# Altium project Board_SN.PrjPcb
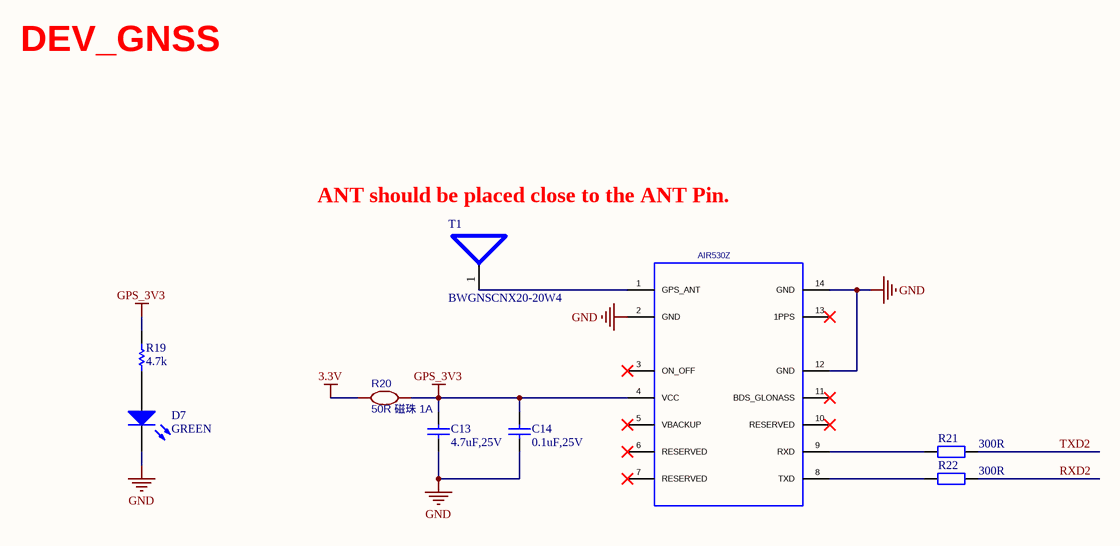
[diagram p0: GNSS.SchDoc]
5 sheets, 108 parts. Net scope: global (net labels, ports and power ports of the same name join across sheets).
Sheets:
  GNSS.SchDoc
  MCU.SchDoc
  Audio.SchDoc
  Device.SchDoc
  POWER.SchDoc

## Sheet GNSS.SchDoc
size A4

### Parts
C13  value 4.7uF,25V  [0402_C]  (hidden comment: Cap)
C14  value 0.1uF,25V  [0402_C]  (hidden comment: Cap)
D7  value GREEN  [0603_LED]  (hidden comment: LED)
R19  value 4.7k  [0603_R]  (hidden comment: Res_5%)
R20  50R 磁珠 1A  [0402_R]
R21  value 300R  [0603_R]  (hidden comment: Res)
R22  value 300R  [0603_R]  (hidden comment: Res)
T1  BWGNSCNX20-20W4  [ANT-TH_BWGNSCNX20-20W4]
U5  AIR530Z  [AIR530]

### Nets
3.3V: R20.2
GND: C13.2 C14.2 D7.2(K) U5.2(GND) U5.12(GND) U5.14(GND)
GPS_3V3: C13.1 C14.1 R19.2 R20.1 U5.4(VCC)
RXD2: R22.2
TXD2: R21.2
NetD7_1: D7.1(A) R19.1
NetR21_1: R21.1 U5.9(RXD)
NetR22_1: R22.1 U5.8(TXD)
NetT1_1: T1.1 U5.1(GPS_ANT)

Not connected (* = marked no-connect by the designer): U5 3(ON_OFF)* 5(VBACKUP)* 6(RESERVED)* 7(RESERVED)* 10(RESERVED)* 11(BDS_GLONASS)* 13(1PPS)*

### Notes on the sheet
- DEV_GNSS
- ANT should be placed close to the ANT Pin.

### Library data of the parts
C13 C14 = T_Cap_0603_0.1uF_25V_X5R: 贴片电容; Part Typer: X5R; Solder: SMD; Withstand Voltage: 25V; Tolerance: 10%; Schematic Path: X:\Database\Schematic Library.Schlib; Part Number: T_Cap_0603_0.1uF_25V_X5R; LibRef: T_Cap_0603_0.1uF_25V_X5R
D7 = T_LED_Red_0805: 红色LED灯; Solder: SMD; Schematic Path: X:\Database\Schematic Library.Schlib; Part Number: T_LED_Red_0805; LibRef: T_LED_Red_0805
R19 = T_Res_0603_10k_5%_1/10W: 贴片电阻; Solder: SMD; Power: 1/10W; Tolerance: 5%; Schematic Path: X:\Database\Schematic Library.Schlib; Part Number: T_Res_0603_10k_5%_1/10W; LibRef: T_Res_0603_10k_5%_1/10W
R20 = 100k: nameAlias: Value(Ω); Contributor: LCEDA_Lib; spicePre: R; spiceSymbolName: R_0603_EU
R21 R22 = T_Res_0603_49.9k_1%_1/10W: 贴片电阻; Solder: SMD; Power: 1/10W; Tolerance: 1%; Schematic Path: X:\Database\Schematic Library.Schlib; Part Number: T_Res_0603_49.9k_1%_1/10W; LibRef: T_Res_0603_49.9k_1%_1/10W
T1 = ANT
U5 = AIR530Z: GPS/Beidou/GLONASS module;9.9*12.9*2.3mm; Manufacture: Luat; Geometry.Height: 2.3mm; Manufacturer P/N: Air530Z; PCB DECAL: AIR530

## Sheet MCU.SchDoc
size A4
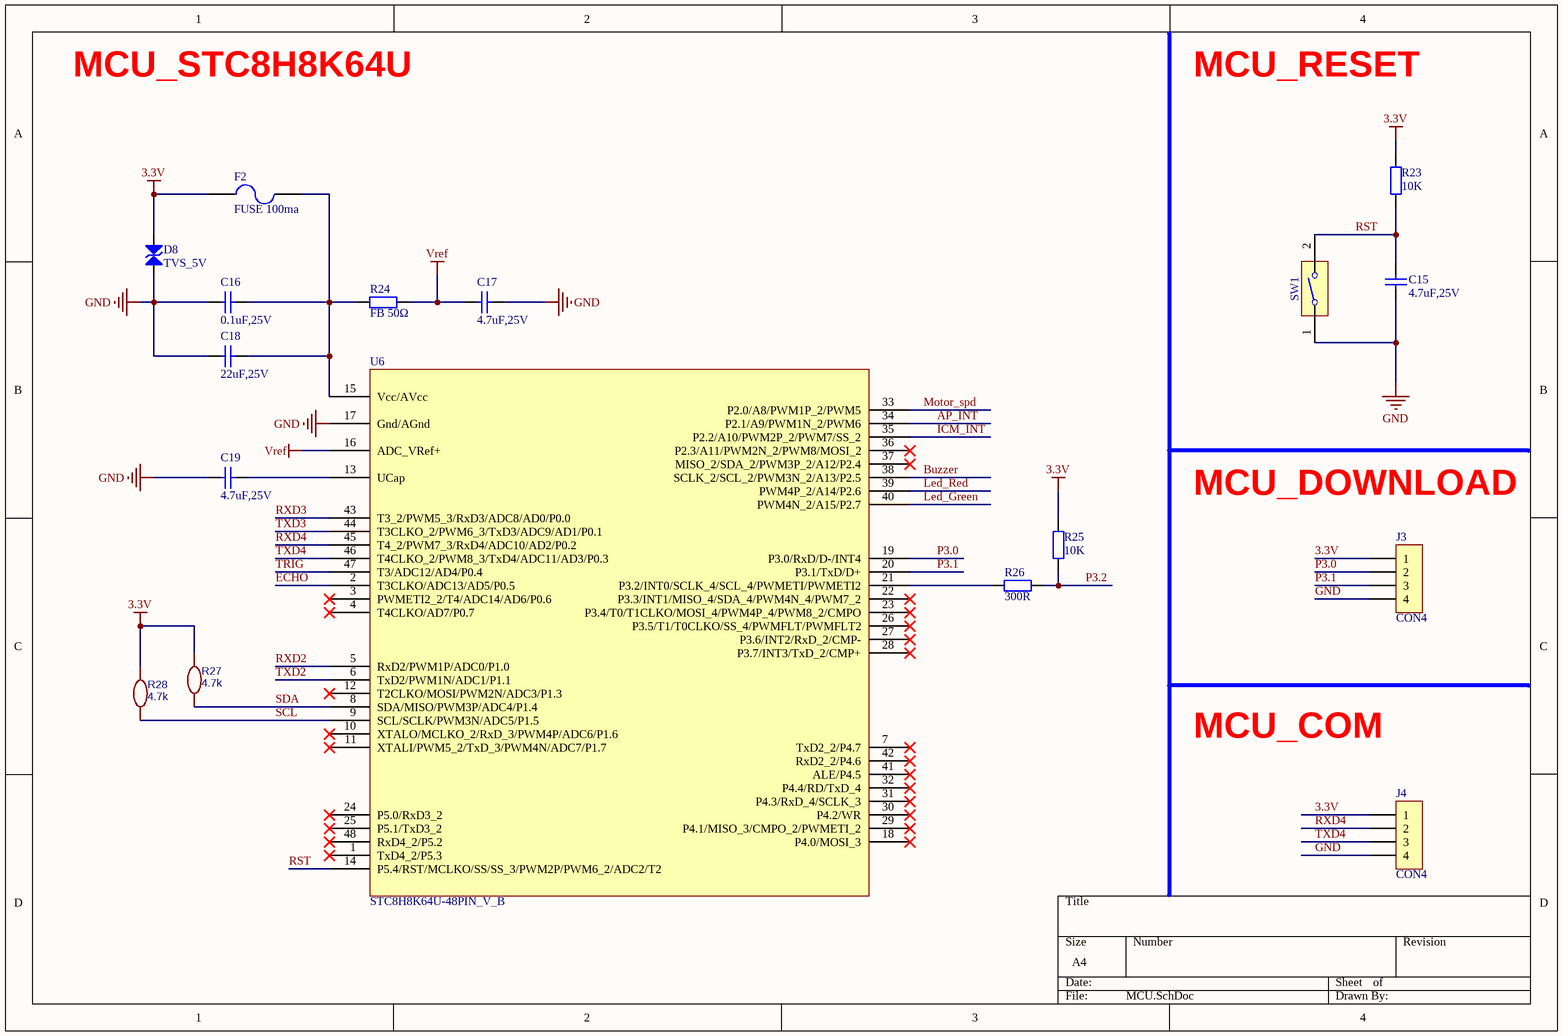
[diagram p1: MCU.SchDoc]

### Parts
C15  value 4.7uF,25V  [0603_C]  (hidden comment: Cap)
C16  value 0.1uF,25V  [0603_C]  (hidden comment: Cap)
C17  value 4.7uF,25V  [0603_C]  (hidden comment: Cap)
C18  value 22uF,25V  [0603_C]  (hidden comment: Cap)
C19  value 4.7uF,25V  [0603_C]  (hidden comment: Cap)
D8  TVS_5V  [SOD-323]
F2  FUSE 100ma  [1206_FUSE]
J3  CON4
J4  CON4
R23  value 10K  [0603_R]  (hidden comment: Res)
R24  value FB 50Ω  [0603_R]  (hidden comment: Res)
R25  value 10K  [0603_R]  (hidden comment: Res)
R26  value 300R  [0603_R]  (hidden comment: Res)
R27  4.7k  [0402_R]
R28  4.7k  [0402_R]
SW1  (no value)
U6  STC8H8K64U-48PIN_V_B  [QFN48(6X6mm)]

### Nets
3.3V: D8.1 F2.2 J3.1 J4.1 R23.1 R25.1 R27.1 R28.1
GND: C15.2 C16.1 C17.1 C18.1 C19.2 D8.2 J3.4 J4.4 SW1.1 U6.17(Gnd/AGnd)
Vref: C17.2 R24.1 U6.16(ADC_VRef+)
AP_INT: U6.34(P2.1/A9/PWM1N_2/PWM6)
Buzzer: U6.38(SCLK_2/SCL_2/PWM3N_2/A13/P2.5)
ECHO: U6.2(T3CLKO/ADC13/AD5/P0.5)
ICM_INT: U6.35(P2.2/A10/PWM2P_2/PWM7/SS_2)
Led_Green: U6.40(PWM4N_2/A15/P2.7)
Led_Red: U6.39(PWM4P_2/A14/P2.6)
Motor_spd: U6.33(P2.0/A8/PWM1P_2/PWM5)
P3.0: J3.2 U6.19(P3.0/RxD/D-/INT4)
P3.1: J3.3 U6.20(P3.1/TxD/D+)
P3.2: R25.2 R26.2
RST: C15.1 R23.2 SW1.2 U6.14(P5.4/RST/MCLKO/SS/SS_3/PWM2P/PWM6_2/ADC2/T2)
RXD2: U6.5(RxD2/PWM1P/ADC0/P1.0)
RXD3: U6.43(T3_2/PWM5_3/RxD3/ADC8/AD0/P0.0)
RXD4: J4.2 U6.45(T4_2/PWM7_3/RxD4/ADC10/AD2/P0.2)
SCL: R28.2 U6.9(SCL/SCLK/PWM3N/ADC5/P1.5)
SDA: R27.2 U6.8(SDA/MISO/PWM3P/ADC4/P1.4)
TRIG: U6.47(T3/ADC12/AD4/P0.4)
TXD2: U6.6(TxD2/PWM1N/ADC1/P1.1)
TXD3: U6.44(T3CLKO_2/PWM6_3/TxD3/ADC9/AD1/P0.1)
TXD4: J4.3 U6.46(T4CLKO_2/PWM8_3/TxD4/ADC11/AD3/P0.3)
NetC16_2: C16.2 C18.2 F2.1 R24.2 U6.15(Vcc/AVcc)
NetC19_1: C19.1 U6.13(UCap)
NetR26_1: R26.1 U6.21(P3.2/INT0/SCLK_4/SCL_4/PWMETI/PWMETI2)

Not connected (* = marked no-connect by the designer): U6 1(TxD4_2/P5.3)* 3(PWMETI2_2/T4/ADC14/AD6/P0.6)* 4(T4CLKO/AD7/P0.7)* 7(TxD2_2/P4.7)* 10(XTALO/MCLKO_2/RxD_3/PWM4P/ADC6/P1.6)* 11(XTALI/PWM5_2/TxD_3/PWM4N/ADC7/P1.7)* 12(T2CLKO/MOSI/PWM2N/ADC3/P1.3)* 18(P4.0/MOSI_3)* 22(P3.3/INT1/MISO_4/SDA_4/PWM4N_4/PWM7_2)* 23(P3.4/T0/T1CLKO/MOSI_4/PWM4P_4/PWM8_2/CMPO)* 24(P5.0/RxD3_2)* 25(P5.1/TxD3_2)* 26(P3.5/T1/T0CLKO/SS_4/PWMFLT/PWMFLT2)* 27(P3.6/INT2/RxD_2/CMP-)* 28(P3.7/INT3/TxD_2/CMP+)* 29(P4.1/MISO_3/CMPO_2/PWMETI_2)* 30(P4.2/WR)* 31(P4.3/RxD_4/SCLK_3)* 32(P4.4/RD/TxD_4)* 36(P2.3/A11/PWM2N_2/PWM8/MOSI_2)* 37(MISO_2/SDA_2/PWM3P_2/A12/P2.4)* 41(ALE/P4.5)* 42(RxD2_2/P4.6)* 48(RxD4_2/P5.2)*

### Notes on the sheet
- MCU_STC8H8K64U
- MCU_RESET
- MCU_DOWNLOAD
- MCU_COM

### Library data of the parts
C15-C19 = T_Cap_0603_2.2uF_25V_Y5V: 贴片电容; Part Typer: Y5V; Solder: SMD; Withstand Voltage: 25V; Tolerance: 20%; Schematic Path: X:\Database\Schematic Library.Schlib; Part Number: T_Cap_0603_2.2uF_25V_Y5V; LibRef: T_Cap_0603_2.2uF_25V_Y5V
D8 = TBV05C: TVS,ESD二极管
F2 = Fuse 2: Fuse; Published: 8-Jun-2000; LatestRevisionDate: 17-Jul-2002; LatestRevisionNote: Re-released for DXP Platform.; PackageReference: PIN-W2/E2.8; Publisher: Altium Limited
J3 J4 = CON4: Connector
R23-R26 = T_Res_0603_49.9k_1%_1/10W: as R21 on sheet GNSS; Part Number: T_Res_0603_49.9k_1%_1/10W; LibRef: T_Res_0603_49.9k_1%_1/10W
R27 R28 = 100k: as R20 on sheet GNSS; spicePre: R; spiceSymbolName: R_0603_EU
SW1 = SW 1x SPST DIP Switch: 1 Ways SPST DIP Switch
U6 = STC8H8K64U-48PIN

## Sheet Audio.SchDoc
size A4
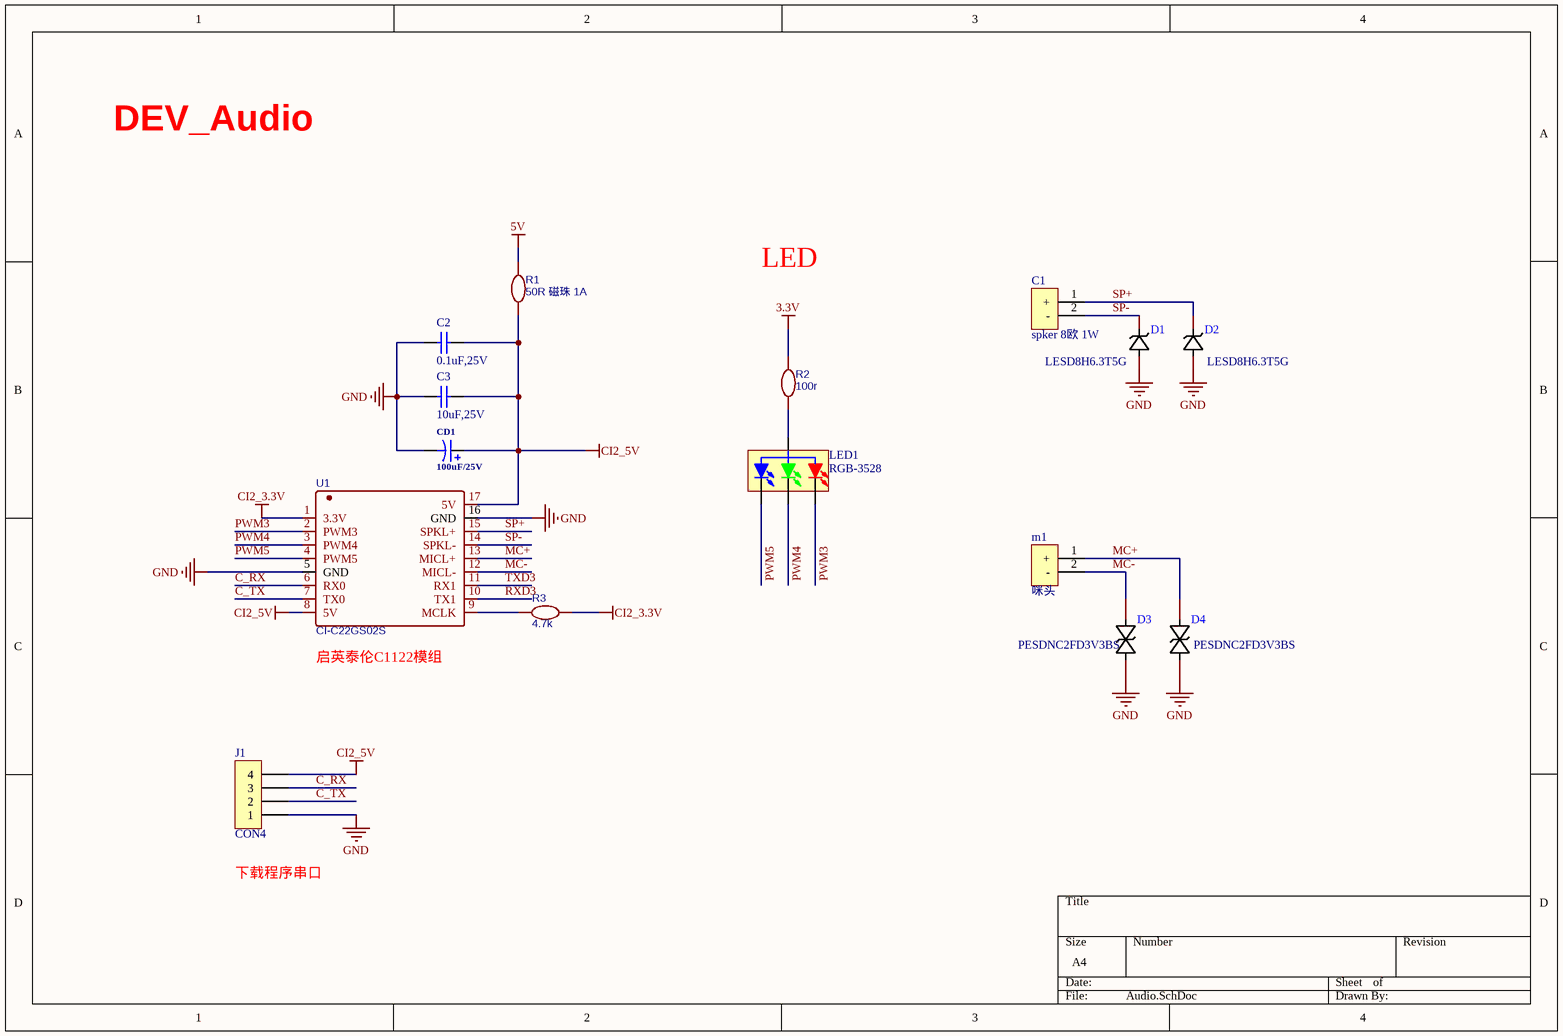
[diagram p2: Audio.SchDoc]

### Parts
C1  spker 8欧 1W  [XH2.54A-2]
C2  value 0.1uF,25V  [0402_C]  (hidden comment: Cap)
C3  value 10uF,25V  [0402_C]  (hidden comment: Cap)
CD1  100uF/25V  [CD7343]
D1  LESD8H6.3T5G  [SOD-882_L1.0-W0.6-R-RD]
D2  LESD8H6.3T5G  [SOD-882_L1.0-W0.6-R-RD]
D3  PESDNC2FD3V3BS  [DFN1006-2L-BI]
D4  PESDNC2FD3V3BS  [DFN1006-2L-BI]
J1  CON4
LED1  RGB-3528  [LED-TH_4P-BD6.9-P1.27-R]
m1  咪头  [MIC-TH_BD6.0-P1.90-D0.4-L-RD]
R1  50R 磁珠 1A  [0402_R]
R2  100r  [0402_R]
R3  4.7k  [0402_R]
U1  CI-C22GS02S  [SMD-17_L20.0-W1.80-CI-C22GS02S]

### Nets
3.3V: R2.2
5V: R1.2
CI2_3.3V: R3.1 U1.1(3.3V)
CI2_5V: C2.1 C3.1 CD1.1 J1.4 R1.1 U1.8(5V) U1.17(5V)
GND: C2.2 C3.2 CD1.2 D1.1(A) D2.1(A) D3.2(K) D4.2(K) J1.1 U1.5(GND) U1.16(GND)
C_RX: J1.3 U1.6(RX0)
C_TX: J1.2 U1.7(TX0)
MC+: D4.1(A) m1.1(+) U1.13(MICL+)
MC-: D3.1(A) m1.2(-) U1.12(MICL-)
PWM3: LED1.1(RED_K) U1.2(PWM3)
PWM4: LED1.3(GREEN_K) U1.3(PWM4)
PWM5: LED1.4(BULE_K) U1.4(PWM5)
RXD3: U1.10(TX1)
SP+: C1.1(+) D2.2(K) U1.15(SPKL+)
SP-: C1.2(-) D1.2(K) U1.14(SPKL-)
TXD3: U1.11(RX1)
NetLED1_2: LED1.2(A) R2.1
NetR3_2: R3.2 U1.9(MCLK)

### Notes on the sheet
- DEV_Audio
- LED
- (near U1) 启英泰伦C1122模组
- (near J1) 下载程序串口

### Library data of the parts
C1 = SPK
C2 C3 = T_Cap_0603_0.1uF_25V_X5R: as C13 on sheet GNSS; Part Number: T_Cap_0603_0.1uF_25V_X5R; LibRef: T_Cap_0603_0.1uF_25V_X5R
CD1 = C-100: 钽电容,Tantalum Capacitors,47uF/16V,3.5*2.8; Published: 8-Jun-2000; LatestRevisionDate: 17-Jul-2002; LatestRevisionNote: Re-released for DXP Platform.; PackageReference: POLAR0.8; Publisher: Altium Limited
D1 D2 = LESD8H6.3T5G: Manufacturer: LRC(乐山无线电); Add into BOM: yes; Polarity: 单向; Reverse Stand-Off Voltage (Vrwm): 6.3V; Breakdown Voltage: 7V; Peak Pulse Current (Ipp)@10/1000μs: 21A@8/20us; Maximum Clamping Voltage: 11V; Name: LESD8H6.3T5G; Symbol: LESD8H6.3T5G; Device: LESD8H6.3T5G; LCSC Part Name: 单向 Vrwm:6.3V; Supplier Part: C383220; Manufacturer Part: LESD8H6.3T5G; Supplier Footprint: SOD-882; JLCPCB Part Class: Extended Part; Datasheet: https://atta.szlcsc.com/upload/public/pdf/source/20200318/C383220_68B8019F200972B4456FCD3E4DB778A0.pdf; Supplier: LCSC; Convert to PCB: yes
D3 D4 = PESDNC2FD3V3BS: Manufacturer: LRC(乐山无线电); Name: LESD8H6.3T5G; Add into BOM: yes; Polarity: 单向; Reverse Stand-Off Voltage (Vrwm): 6.3V; Breakdown Voltage: 7V; Peak Pulse Current (Ipp)@10/1000μs: 21A@8/20us; Maximum Clamping Voltage: 11V; Symbol: LESD8H6.3T5G; Device: LESD8H6.3T5G; LCSC Part Name: 单向 Vrwm:6.3V; Supplier Part: C383220; Manufacturer Part: LESD8H6.3T5G; Supplier Footprint: SOD-882; JLCPCB Part Class: Extended Part; Datasheet: https://atta.szlcsc.com/upload/public/pdf/source/20200318/C383220_68B8019F200972B4456FCD3E4DB778A0.pdf; Supplier: LCSC; Convert to PCB: yes
J1 = CON4: Connector
LED1 = LED-RGB-3528: 三基色LED; 版权归属: 源创客; BOM名称: 三基色LED; 学习资源: www.ooocke.com
m1 = mic
R1-R3 = 100k: as R20 on sheet GNSS; spicePre: R; spiceSymbolName: R_0603_EU
U1 = CI-C22GS02S: BOM_Manufacturer: Chiplntelli(启英泰伦); Contributor: LCSC; BOM_Supplier: LCSC; BOM_Supplier Part: C2759836; BOM_Manufacturer Part: CI-C22GS02S; BOM_JLCPCB Part Class: Extended Part; spicePre: U; spiceSymbolName: CI-C22GS02S

## Sheet Device.SchDoc
size A4
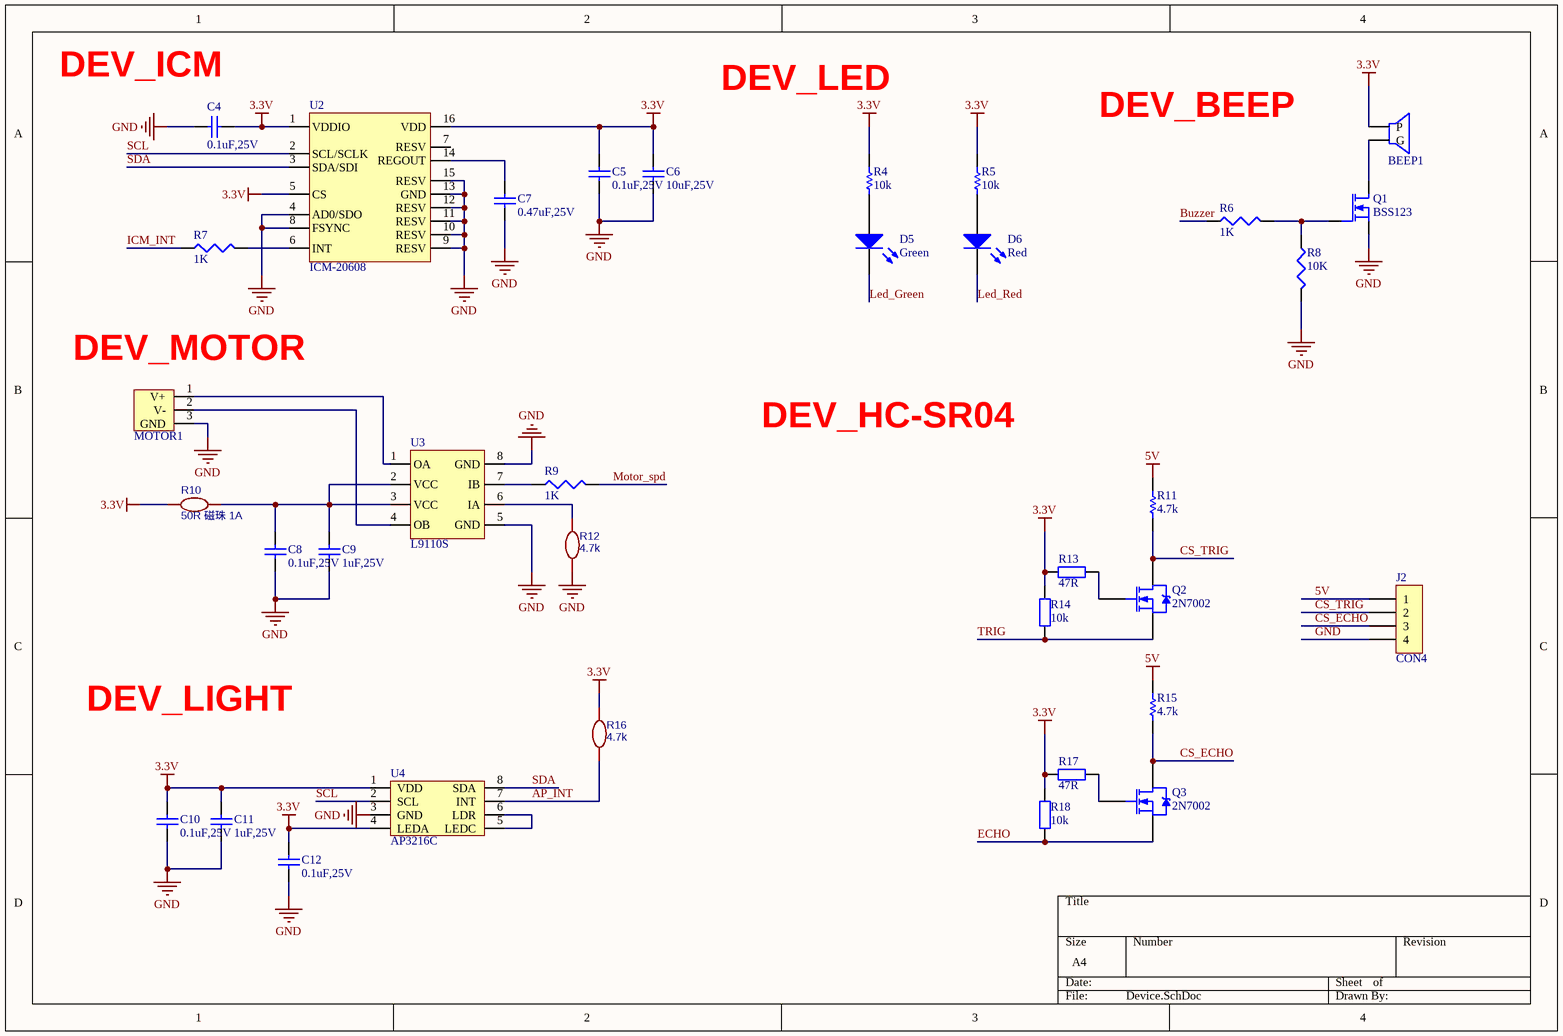
[diagram p3: Device.SchDoc]

### Parts
BEEP1  BEEP  [BEEP]  (value not drawn)
C4  value 0.1uF,25V  [0402_C]  (hidden comment: Cap)
C5  value 0.1uF,25V  [0402_C]  (hidden comment: Cap)
C6  value 10uF,25V  [0402_C]  (hidden comment: Cap)
C7  value 0.47uF,25V  [0402_C]  (hidden comment: Cap)
C8  value 0.1uF,25V  [0402_C]  (hidden comment: Cap)
C9  value 1uF,25V  [0402_C]  (hidden comment: Cap)
C10  value 0.1uF,25V  [0402_C]  (hidden comment: Cap)
C11  value 1uF,25V  [0402_C]  (hidden comment: Cap)
C12  value 0.1uF,25V  [0402_C]  (hidden comment: Cap)
D5  value Green  [0603_LED]  (hidden comment: LED)
D6  value Red  [0603_LED]  (hidden comment: LED)
J2  CON4
MOTOR1  Motor-SMD  [MOTOR-SMD]  (value not drawn)
Q1  BSS123  [SOT-23]
Q2  value 2N7002  [SOT-23!!!]  (hidden comment: NMOS)
Q3  value 2N7002  [SOT-23!!!]  (hidden comment: NMOS)
R4  value 10k  [0603_R]  (hidden comment: Res_5%)
R5  value 10k  [0603_R]  (hidden comment: Res_5%)
R6  1K  [0603_R]
R7  1K  [0603_R]
R8  10K  [0603_R]
R9  1K  [0603_R]
R10  50R 磁珠 1A  [0402_R]
R11  value 4.7k  [0603_R]  (hidden comment: Res_5%)
R12  4.7k  [0402_R]
R13  47R  [0603_R]
R14  value 10k  [0603_R]  (hidden comment: Res)
R15  value 4.7k  [0603_R]  (hidden comment: Res_5%)
R16  4.7k  [0402_R]
R17  47R  [0603_R]
R18  value 10k  [0603_R]  (hidden comment: Res)
U2  ICM-20608  [LGA-16-3*3*0.75]
U3  L9110S  [SOP-8]
U4  AP3216C  [QFN-8-2.4*4.1]

### Nets
3.3V: BEEP1.1(P) C4.1 C5.1 C6.1 C10.1 C11.1 C12.1 R4.2 R5.2 R10.2 R13.1 R14.2 R16.1 R17.1 R18.2 U2.1(VDDIO) U2.5(CS) U2.16(VDD) U4.1(VDD) U4.4(LEDA)
5V: J2.1 R11.2 R15.2
GND: C4.2 C5.2 C6.2 C7.2 C8.2 C9.2 C10.2 C11.2 C12.2 J2.4 MOTOR1.3(GND) Q1.S R8.2 R12.2 U2.4(AD0/SDO) U2.8(FSYNC) U2.9(RESV) U2.10(RESV) U2.11(RESV) U2.12(RESV) U2.13(GND) U2.15(RESV) U3.5(GND) U3.8(GND) U4.3(GND)
AP_INT: R16.2 U4.7(INT)
Buzzer: R6.1
CS_ECHO: J2.3 Q3.2(D) R15.1
CS_TRIG: J2.2 Q2.2(D) R11.1
ECHO: Q3.3(S) R18.1
ICM_INT: R7.1
Led_Green: D5.2(K)
Led_Red: D6.2(K)
Motor_spd: R9.2
SCL: U2.2(SCL/SCLK) U4.2(SCL)
SDA: U2.3(SDA/SDI) U4.8(SDA)
TRIG: Q2.3(S) R14.1
NetBEEP1_2: BEEP1.2(G) Q1.D
NetC7_1: C7.1 U2.14(REGOUT)
NetC8_1: C8.1 C9.1 R10.1 U3.2(VCC) U3.3(VCC)
NetD5_1: D5.1(A) R4.1
NetD6_1: D6.1(A) R5.1
NetMOTOR1_1: MOTOR1.1(V+) U3.1(OA)
NetMOTOR1_2: MOTOR1.2(V-) U3.4(OB)
NetQ1_G: Q1.G R6.2 R8.1
NetQ2_1: Q2.1(G) R13.2
NetQ3_1: Q3.1(G) R17.2
NetR7_2: R7.2 U2.6(INT)
NetR9_1: R9.1 U3.7(IB)
NetR12_1: R12.1 U3.6(IA)
NetU4_5: U4.5(LEDC) U4.6(LDR)

Not connected (* = marked no-connect by the designer): U2 7(RESV)

### Notes on the sheet
- (near C4) DEV_ICM
- DEV_LED
- DEV_BEEP
- (near MOTOR1) DEV_MOTOR
- DEV_HC-SR04
- DEV_LIGHT

### Library data of the parts
BEEP1 = BEEP: 3.3V有源蜂鸣器
C4-C12 = T_Cap_0603_0.1uF_25V_X5R: as C13 on sheet GNSS; Part Number: T_Cap_0603_0.1uF_25V_X5R; LibRef: T_Cap_0603_0.1uF_25V_X5R
D5 D6 = T_LED_Red_0805: as D7 on sheet GNSS; Part Number: T_LED_Red_0805; LibRef: T_LED_Red_0805
J2 = CON4: Connector
MOTOR1 = Motor-SMD: 电机,SMD
Q1 = BSS123: Mosfet, N-channel, Vds:100V, Id:0.15A, Vgs-th:2.8V, Rds-on:3.5ohm; Brand: NXP; Drain Current: 0.15A; Drain Source Voltage: 100V; Gate Source Voltage: 20V; On Resistance: 3.5ohm; Threshold Voltage: 2.8V; Brand Number: BSS123; Case Style: SOT-23; Order Code Supplier: 1510764; Price: 0,082; Supplier: Farnell; Temperature Range: -55°C to +150°C; Transistor Polarity: N-channel
Q2 Q3 = T_2N7002: Solder: SMD; Vds: 60 V; Id: 0.115 A; Rds: 1.1 Ohms; Schematic Path: X:\Database\Schematic Library.Schlib; Part Number: T_2N7002; LibRef: T_2N7002; ComponentLink2Description: Datasheet
R4 R5 = T_Res_0603_10k_5%_1/10W: as R19 on sheet GNSS; Part Number: T_Res_0603_10k_5%_1/10W; LibRef: T_Res_0603_10k_5%_1/10W
R6-R9 = 1.5k/0402/0063W/50V: Resistor, 1.5k, 0.1%, 0.0625W, 50V, 100PPM, 0402; Brand: VISHAY DRALORIC; Brand Number: CRCW04021K50FKED; Case Style: 0402; Power Rating: 0.063W; Order Code Supplier: 2121624; Price: 0,0054; Resistance: 1.5k; Supplier: Farnell; Temperature Coefficient: ± 100PPM; Temperature Range: -55°C to +125°C; Voltage Rating: 50V
R10 R12 R16 = 100k: as R20 on sheet GNSS; spicePre: R; spiceSymbolName: R_0603_EU
R11 R15 = T_Res_0603_4.3k_5%_1/10W: 贴片电阻; Solder: SMD; Power: 1/10W; Tolerance: 5%; Schematic Path: X:\Database\Schematic Library.Schlib; Part Number: T_Res_0603_4.3k_5%_1/10W; LibRef: T_Res_0603_4.3k_5%_1/10W
R13 R17 = Res
R14 R18 = T_Res_0603_10k_1%_1/10W: 贴片电阻; Solder: SMD; Power: 1/10W; Tolerance: 1%; Schematic Path: X:\Database\Schematic Library.Schlib; Part Number: T_Res_0603_10k_1%_1/10W; LibRef: T_Res_0603_10k_1%_1/10W
U2 = U-ICM-20608: 三轴陀螺仪/三轴加速度计,
U3 = U-L9110S: 电机驱动,800mA
U4 = U-AP3216C: Sensor.光照/距离

## Sheet POWER.SchDoc
size A4
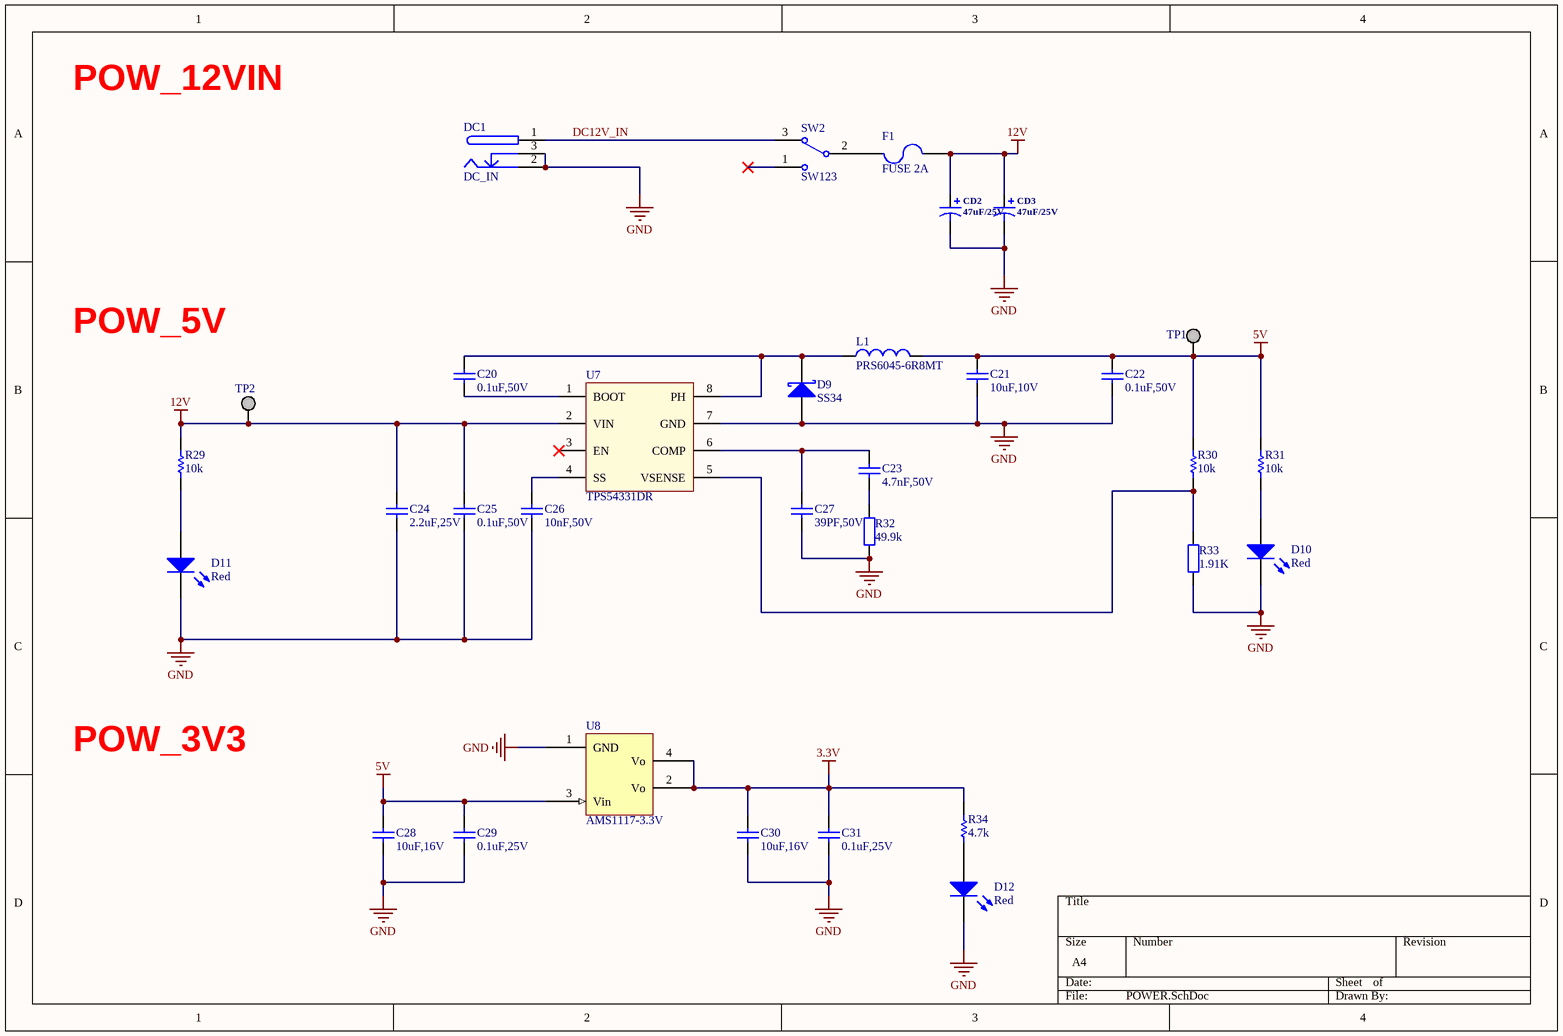
[diagram p4: POWER.SchDoc]

### Parts
C20  value 0.1uF,50V  [0603_C]  (hidden comment: Cap)
C21  value 10uF,10V  [0603_C]  (hidden comment: Cap)
C22  value 0.1uF,50V  [0603_C]  (hidden comment: Cap)
C23  value 4.7nF,50V  [0603_C]  (hidden comment: Cap)
C24  value 2.2uF,25V  [0603_C]  (hidden comment: Cap)
C25  value 0.1uF,50V  [0603_C]  (hidden comment: Cap)
C26  value 10nF,50V  [0603_C]  (hidden comment: Cap)
C27  value 39PF,50V  [0603_C]  (hidden comment: Cap)
C28  value 10uF,16V  [0603_C]  (hidden comment: Cap)
C29  value 0.1uF,25V  [0603_C]  (hidden comment: Cap)
C30  value 10uF,16V  [0603_C]  (hidden comment: Cap)
C31  value 0.1uF,25V  [0603_C]  (hidden comment: Cap)
CD2  47uF/25V  [CD7343]
CD3  47uF/25V  [CD7343]
D9  value SS34  [DO-214AC]  (hidden comment: Diode Schottky)
D10  value Red  [0603_LED]  (hidden comment: LED)
D11  value Red  [0603_LED]  (hidden comment: LED)
D12  value Red  [0603_LED]  (hidden comment: LED)
DC1  DC_IN  [PJ-058A]
F1  FUSE 2A  [1206_FUSE]
L1  value PRS6045-6R8MT  [IND-SMD_L5.8-W5.2]  (hidden comment: Inductors)
R29  value 10k  [0603_R]  (hidden comment: Res_5%)
R30  value 10k  [0603_R]  (hidden comment: Res_5%)
R31  value 10k  [0603_R]  (hidden comment: Res_5%)
R32  value 49.9k  [0603_R]  (hidden comment: Res)
R33  value 1.91K  [0603_R]  (hidden comment: Res)
R34  value 4.7k  [0603_R]  (hidden comment: Res_5%)
SW2  SW123  [SW-TH_SS-12D10L9]
TP1  TP  [TP_H]  (value not drawn)  (no BOM)
TP2  TP  [TP_H]  (value not drawn)  (no BOM)
U7  TPS54331DR  [SOIC8]
U8  value AMS1117-3.3V  [SOT223]  (hidden comment: AMS1117)

### Nets
3.3V: C30.2 C31.2 R34.2 U8.2(Vo) U8.4(Vo)
5V: C21.2 C22.2 C28.2 C29.2 L1.2 R30.2 R31.2 TP1.1 U8.3(Vin)
12V: C24.2 C25.2 CD2.1 CD3.1 F1.1 R29.2 TP2.1 U7.2(VIN)
GND: C21.1 C22.1 C24.1 C25.1 C26.2 C27.1 C28.1 C29.1 C30.1 C31.1 CD2.2 CD3.2 D9.1(A) D10.2(K) D11.2(K) D12.2(K) DC1.2 DC1.3 R32.1 R33.1 U7.7(GND) U8.1(GND)
DC12V_IN: DC1.1 SW2.3
NetC20_1: C20.1 U7.1(BOOT)
NetC20_2: C20.2 D9.2(K) L1.1 U7.8(PH)
NetC23_1: C23.1 R32.2
NetC23_2: C23.2 C27.2 U7.6(COMP)
NetC26_1: C26.1 U7.4(SS)
NetD10_1: D10.1(A) R31.1
NetD11_1: D11.1(A) R29.1
NetD12_1: D12.1(A) R34.1
NetF1_2: F1.2 SW2.2
NetR30_1: R30.1 R33.2 U7.5(VSENSE)

Not connected (* = marked no-connect by the designer): SW2 1*; U7 3(EN)*

### Notes on the sheet
- POW_12VIN
- POW_5V
- POW_3V3

### Library data of the parts
C20 C22 C25 = T_Cap_0603_0.1uF_50V_Y5V: 贴片电容; Part Typer: Y5V; Solder: SMD; Withstand Voltage: 50V; Tolerance: 20%; Schematic Path: X:\Database\Schematic Library.Schlib; Part Number: T_Cap_0603_0.1uF_50V_Y5V; LibRef: T_Cap_0603_0.1uF_50V_Y5V
C21 = T_Cap_0603_22uF_10V_X5R: 贴片电容; Part Typer: X5R; Solder: SMD; Withstand Voltage: 10V; Tolerance: 20%; Schematic Path: X:\Database\Schematic Library.Schlib; Part Number: T_Cap_0603_22uF_10V_X5R; LibRef: T_Cap_0603_22uF_10V_X5R
C23 = T_Cap_0603_4.7nF_50V_X7R: 贴片电容; Part Typer: X7R; Solder: SMD; Withstand Voltage: 50V; Tolerance: 10%; Schematic Path: X:\Database\Schematic Library.Schlib; Part Number: T_Cap_0603_4.7nF_50V_X7R; LibRef: T_Cap_0603_4.7nF_50V_X7R
C24 = T_Cap_0603_2.2uF_25V_Y5V: as C15 on sheet MCU; Part Number: T_Cap_0603_2.2uF_25V_Y5V; LibRef: T_Cap_0603_2.2uF_25V_Y5V
C26 = T_Cap_0603_10nF_50V_X7R: 贴片电容; Part Typer: X7R; Solder: SMD; Withstand Voltage: 50V; Tolerance: 10%; Schematic Path: X:\Database\Schematic Library.Schlib; Part Number: T_Cap_0603_10nF_50V_X7R; LibRef: T_Cap_0603_10nF_50V_X7R
C27 = T_Cap_0603_39PF_50V_C0G: 贴片电容; Part Typer: C0G; Solder: SMD; Withstand Voltage: 50V; Tolerance: 5%; Schematic Path: X:\Database\Schematic Library.Schlib; Part Number: T_Cap_0603_39PF_50V_C0G; LibRef: T_Cap_0603_39PF_50V_C0G
C28 C30 = T_Cap_0603_10uF_16V_X5R: 贴片电容; Part Typer: X5R; Solder: SMD; Withstand Voltage: 16V; Tolerance: 10%; Schematic Path: X:\Database\Schematic Library.Schlib; Part Number: T_Cap_0603_10uF_16V_X5R; LibRef: T_Cap_0603_10uF_16V_X5R
C29 C31 = T_Cap_0603_0.1uF_25V_X5R: as C13 on sheet GNSS; Part Number: T_Cap_0603_0.1uF_25V_X5R; LibRef: T_Cap_0603_0.1uF_25V_X5R
CD2 CD3 = C-100: 钽电容,Tantalum Capacitors,47uF/16V,3.5*2.8; Published: 8-Jun-2000; LatestRevisionDate: 17-Jul-2002; LatestRevisionNote: Re-released for DXP Platform.; PackageReference: POLAR0.8; Publisher: Altium Limited
D9 = T_SS34: 肖特基二极管; Part Number: T_SS34; Solder: SMD; Schematic Path: X:\Database\Schematic Library.Schlib; LibRef: T_SS34
D10-D12 = T_LED_Red_0805: as D7 on sheet GNSS; Part Number: T_LED_Red_0805; LibRef: T_LED_Red_0805
DC1 = DC_IN: DC插座; Supplier: *; SupplierPartNumber: *
F1 = Fuse 2: Fuse; Published: 8-Jun-2000; LatestRevisionDate: 17-Jul-2002; LatestRevisionNote: Re-released for DXP Platform.; PackageReference: PIN-W2/E2.8; Publisher: Altium Limited
L1 = T_PRS6045-6R8MT: 贴片电感; Solder: SMD; Tolerance: 20%; Rated Current: 3.8A; Schematic Path: X:\Database\Schematic Library.Schlib; Part Number: T_PRS6045-6R8MT; LibRef: T_PRS6045-6R8MT
R29-R31 R34 = T_Res_0603_10k_5%_1/10W: as R19 on sheet GNSS; Part Number: T_Res_0603_10k_5%_1/10W; LibRef: T_Res_0603_10k_5%_1/10W
R32 = T_Res_0603_49.9k_1%_1/10W: as R21 on sheet GNSS; Part Number: T_Res_0603_49.9k_1%_1/10W; LibRef: T_Res_0603_49.9k_1%_1/10W
R33 = T_Res_0603_1.91k_1%_1/10W: 贴片电阻; Solder: SMD; Power: 1/10W; Tolerance: 1%; Schematic Path: X:\Database\Schematic Library.Schlib; Part Number: T_Res_0603_1.91k_1%_1/10W; LibRef: T_Res_0603_1.91k_1%_1/10W
SW2 = SW123: C319011
TP1 TP2 = T_TestPoint_H: 测试点_过孔; Solder: DIP; Schematic Path: X:\Database\Schematic Library.Schlib; Part Number: T_TestPoint_H; LibRef: T_TestPoint_H
U7 = TPS54331: TI, 3A, 3.5-28V, Buck
U8 = T_AMS1117-3.3V: 电源芯片; Solder: SMD; Schematic Path: X:\Database\Schematic Library.Schlib; Part Number: T_AMS1117-3.3V; LibRef: T_AMS1117-3.3V; ComponentLink2Description: Datasheet; ComponentLink2URL: X:\Database\Datasheet\AMS1117.pdf

## Nets that join several sheets
3.3V: GNSS (R20.2), MCU (8 pins), Audio (R2.2), Device (20 pins), POWER (5 pins)
5V: Audio (R1.2), Device (J2.1 R11.2 R15.2), POWER (9 pins)
GND: GNSS (6 pins), MCU (10 pins), Audio (10 pins), Device (25 pins), POWER (22 pins)
AP_INT: MCU (U6.34), Device (R16.2 U4.7)
Buzzer: MCU (U6.38), Device (R6.1)
ECHO: MCU (U6.2), Device (Q3.3 R18.1)
ICM_INT: MCU (U6.35), Device (R7.1)
Led_Green: MCU (U6.40), Device (D5.2)
Led_Red: MCU (U6.39), Device (D6.2)
Motor_spd: MCU (U6.33), Device (R9.2)
RXD2: GNSS (R22.2), MCU (U6.5)
RXD3: MCU (U6.43), Audio (U1.10)
SCL: MCU (R28.2 U6.9), Device (U2.2 U4.2)
SDA: MCU (R27.2 U6.8), Device (U2.3 U4.8)
TRIG: MCU (U6.47), Device (Q2.3 R14.1)
TXD2: GNSS (R21.2), MCU (U6.6)
TXD3: MCU (U6.44), Audio (U1.11)